# Altium schematic sheet Interface_CAN.SchDoc
size Legal; SPICEModelCacheOQIDUCOR: <root> / <DocumentId>OQIDUCOR</DocumentId> / <CacheFrame Number="0"> / <Model Name="npn" Kind="MDL"> / <Text>*Default NPN BJT / *NPN Trans Pinout: C,B,E / .MODEL NPN NPN()</Text> / </Model> / </CacheFrame> / </root>
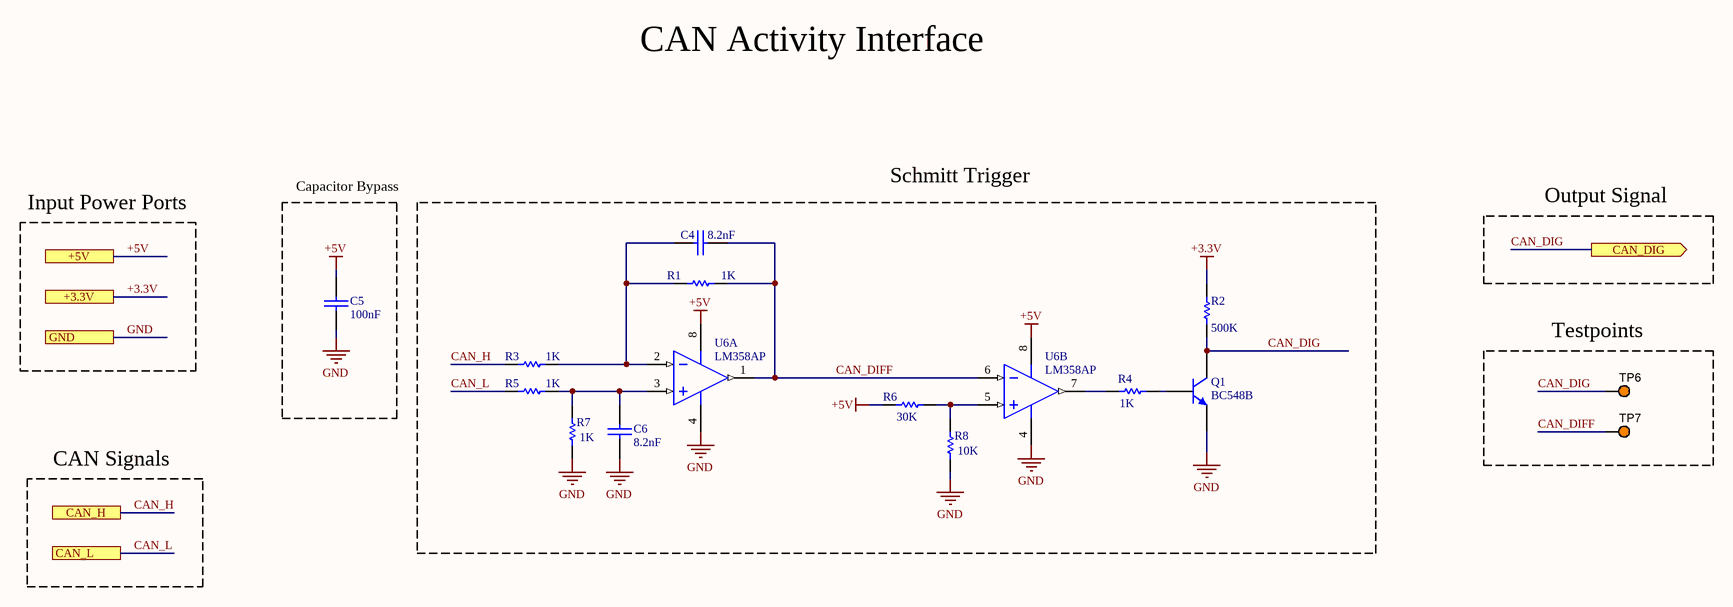
[diagram p0: Interface_CAN.SchDoc]

## Parts
C4  8.2nF  [CAP200]
C5  100nF  [CAP200]
C6  8.2nF  [CAP200]
Q1  BC548B  [TO-226-AA]
R1  value 1K  [AXIAL-0.3]  (hidden comment: Res1)
R2  value 500K  [AXIAL-0.3]  (hidden comment: Res1)
R3  value 1K  [AXIAL-0.3]  (hidden comment: Res1)
R4  value 1K  [AXIAL-0.3]  (hidden comment: Res1)
R5  value 1K  [AXIAL-0.3]  (hidden comment: Res1)
R6  value 30K  [AXIAL-0.3]  (hidden comment: Res1)
R7  value 1K  [AXIAL-0.3]  (hidden comment: Res1)
R8  value 10K  [AXIAL-0.3]  (hidden comment: Res1)
TP6  5003  [KSTN-5003]  (value not drawn)
TP7  5003  [KSTN-5003]  (value not drawn)
U6  LM358AP  [P0008A]  (parts A,B of 2)

## Blocks framed on the sheet
Capacitor Bypass: C5
Schmitt Trigger: C4 C6 Q1 R1-R8 U6
Testpoints: TP6 TP7

## Ports
+3.3V, +5V, CAN_DIG (out), CAN_H, CAN_L, GND

## Nets
+3.3V: R2.2 ; port +3.3V
+5V: C5.1 R6.1 U6.8(VCC) ; port +5V
GND: C5.2 C6.2 Q1.3(E) R7.1 R8.2 U6.4(GND) ; port GND
CAN_DIFF: C4.2 R1.2 TP7.1 U6.1(1OUT) U6.6(2IN-)
CAN_DIG: Q1.1(C) R2.1 TP6.1 ; port CAN_DIG
CAN_H: R3.1 ; port CAN_H
CAN_L: R5.1 ; port CAN_L
NetC4_1: C4.1 R1.1 R3.2 U6.2(1IN-)
NetC6_1: C6.1 R5.2 R7.2 U6.3(1IN+)
NetQ1_2: Q1.2(B) R4.2
NetR4_1: R4.1 U6.7(2OUT)
NetR6_2: R6.2 R8.1 U6.5(2IN+)

## Notes on the sheet
- CAN Activity Interface
- Input Power Ports
- Output Signal
- CAN Signals

## Library data of the parts
C4-C6 = CAP
Q1 = NPN: NPN Bipolar Transistor; Published: 8-Jun-2000; LatestRevisionDate: 17-Jul-2002; LatestRevisionNote: Re-released for DXP Platform.; PackageReference: TO-226-AA; Publisher: Altium Limited; PackageDescription: TO, Flat Index; 3 In-Line, Axial Leads; Body Dia. 4.8mm; Leads 0.55 x 0.51 mm (max); Code_JEDEC: TO-226-AA
R1-R8 = Res1: Resistor; Published: 8-Jun-2000; LatestRevisionDate: 17-Jul-2002; LatestRevisionNote: Re-released for DXP Platform.; PackageReference: AXIAL-0.3; Publisher: Altium Limited; PackageDescription: Axial Device, Thru-Hole; 2 Leads; 0.3 in Pin Spacing
TP6 TP7 = CMP-002-00037-2: Test Point, Orange, Height 4.6 mm, Tail Length 3 mm, 1-Pin THD, RoHS; Manufacturer: Keystone; Colour: Orange; Packaging: Bulk; Package Description: 1-Pin Through Hole Device, Dia 2.54 mm; Pins: 1; Package Reference: 5003; Datasheet Version: Jun-15; Case/Package: 5003; Mounting Technology: TH; Connector Type: TestPoint; Diameter: 2.54mm; Contact Material: Bronze; Datasheet URL: http://keyelco.com/userAssets/file/M65p56.pdf; Manufacturer URL: http://www.keyelco.com/; Package Quantity: 10; Contact Plating: Tin; RoHS Compliant: True
U6 = CMP-014-00023-2: Dual Operational Amplifier, 3 to 32 V, 0 to 70 degC, 8-Pin PDIP (P), Pb-Free (RoHS), Tube; Manufacturer: Texas Instruments (TI); Channels: 2; Max Dual Supply Voltage: 16V; Min Dual Supply Voltage: 1.5V; Slew Rate: 0.3V/us; Unity Gain Bandwidth Product: 700KHz; Common Mode Rejection Ratio: 65dB; Nominal Supply Voltage: 5V; Package Version: 4040082/E, 04/2010; Output Current: 30mA; Nominal Supply Current: 1.2mA; Nominal Voltage Gain: 100dB; Case/Package: DIP; Max Operating Temperature: 70°C; RoHS Compliant: True; Manufacturer URL: http://www.ti.com/; Pins: 8; Package Description: 8-Pin Double In-line Package, Body 9.59 x 6.35 mm, Pitch 2.54 mm; Datasheet URL: http://www.ti.com/lit/ds/symlink/lm358a.pdf; Max Supply Voltage: 16V; Package Reference: P0008A; Mounting Technology: TH; Min Operating Temperature: 0°C; Package URL: http://www.ti.com/lit/ml/mpdi001b/mpdi001b.pdf; Min Supply Voltage: 1.5V; Package Quantity: 50; Packaging: Rail/Tube; Datasheet Version: SLOS068T, 04/2015; Nominal Gain Bandwith Product: 700KHz